# EAGLE design driver_board (EAGLE 7.5.0)

## Sheet 1 of 2
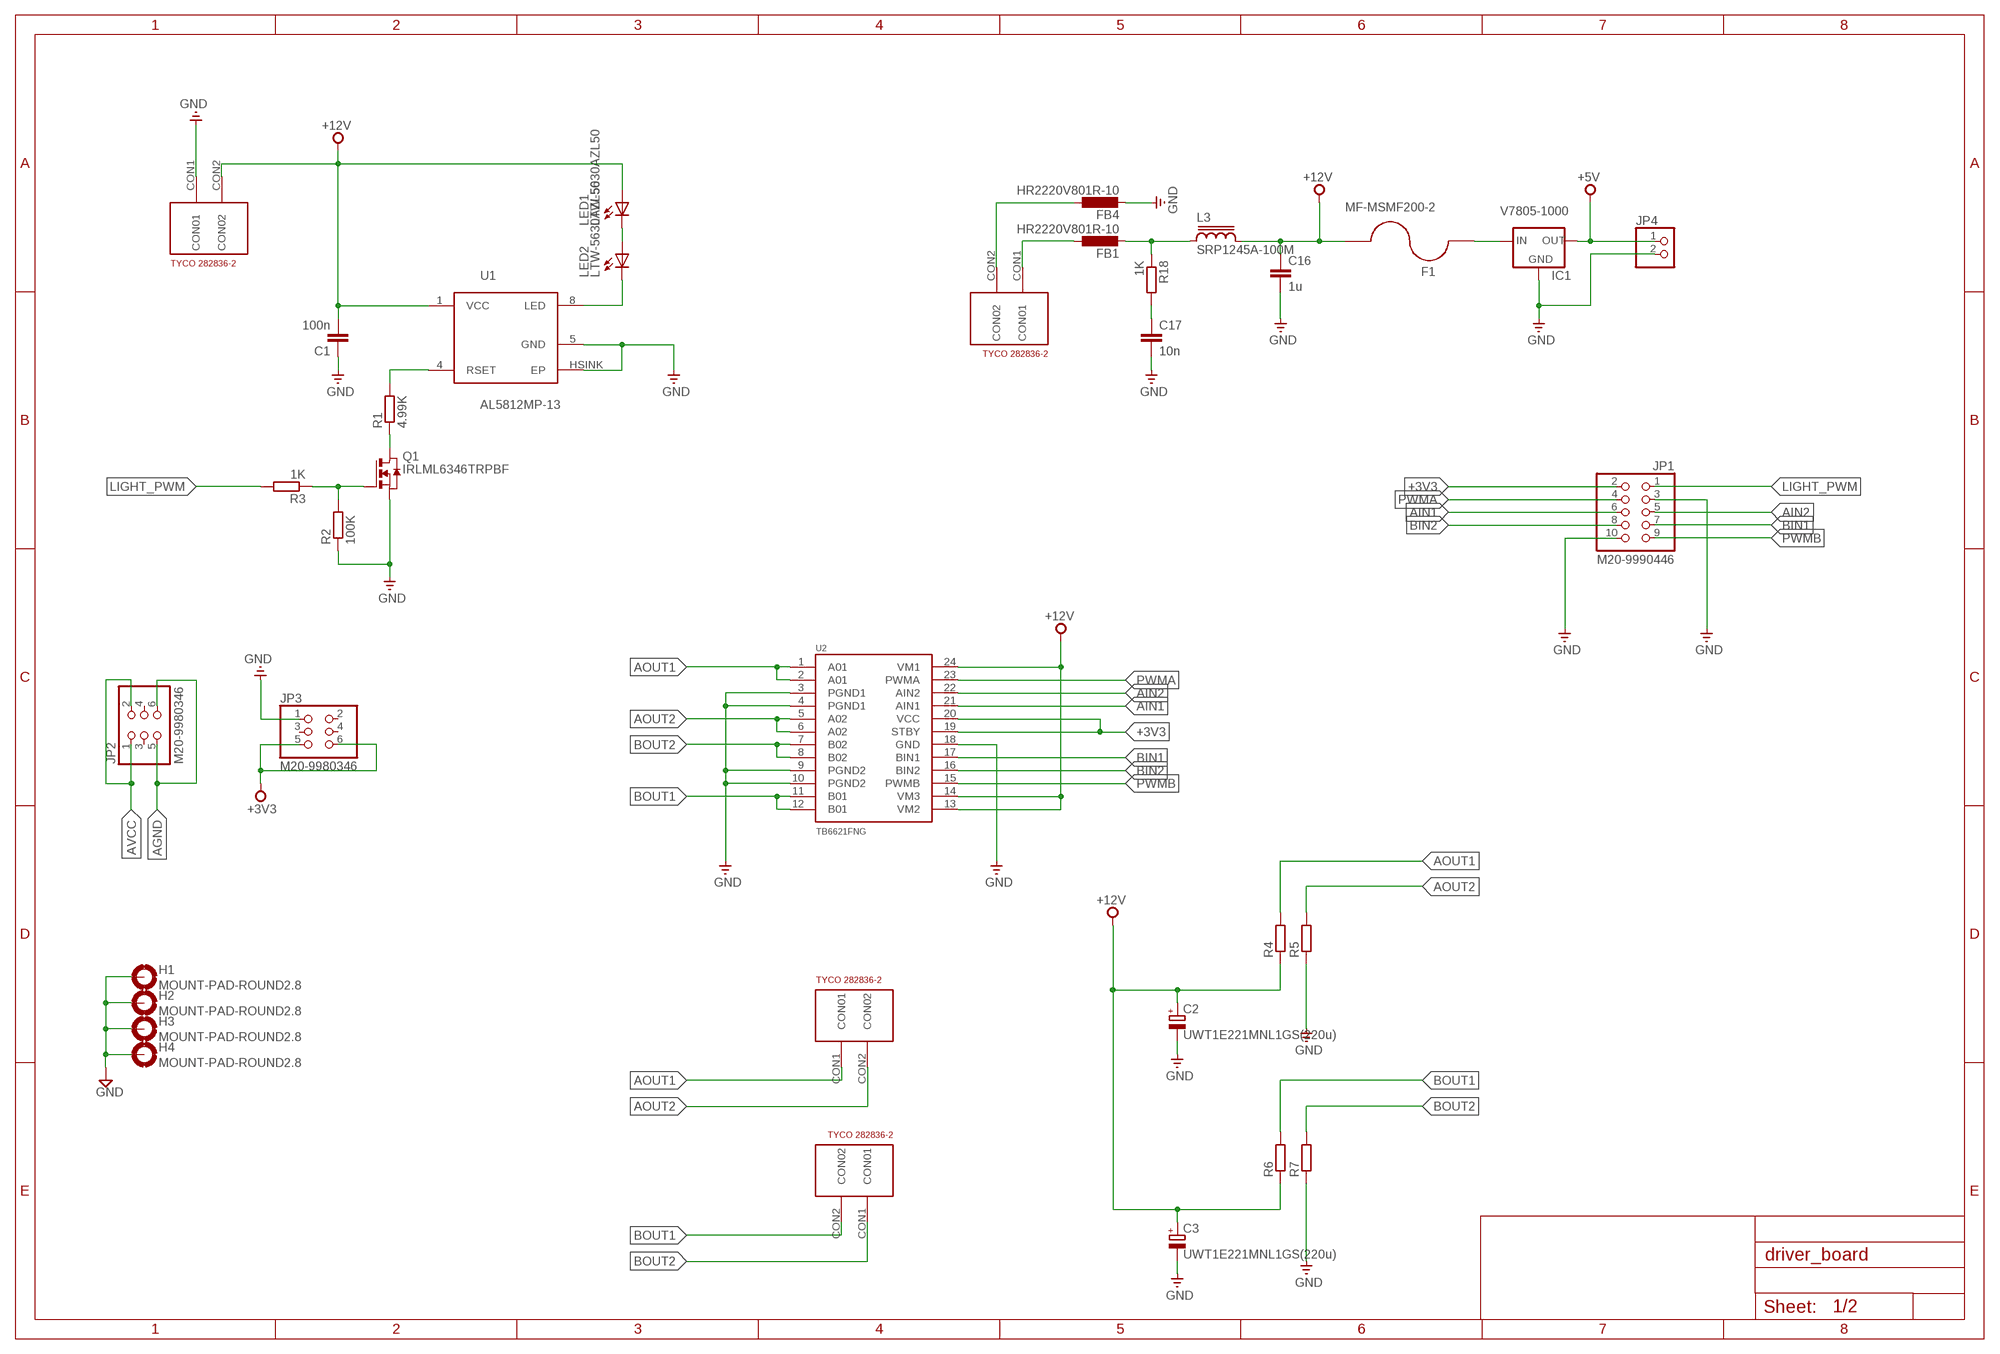
[diagram p0: schematic, sheet 1]

### Parts
C1  100n  C-EUC0402  [C0402]
C2  UWT1E221MNL1GS(220u)  CPOL-EU153CLV-0810  [153CLV-0810]
C3  UWT1E221MNL1GS(220u)  CPOL-EU153CLV-0810  [153CLV-0810]
C16  1u  C-EUC0402  [C0402]
C17  10n  C-EUC0402  [C0402]
F1  MF-MSMF200-2  MF-MSMF075/24  [1812]
FB1  HR2220V801R-10  L-EUL5650M  [L5650M]
FB4  HR2220V801R-10  L-EUL5650M  [L5650M]
H1  MOUNT-PAD-ROUND2.8  [2,8-PAD]
H2  MOUNT-PAD-ROUND2.8  [2,8-PAD]
H3  MOUNT-PAD-ROUND2.8  [2,8-PAD]
H4  MOUNT-PAD-ROUND2.8  [2,8-PAD]
IC1  V7805-1000  VR_1OUTXX  [DIP_3PIN]
JP1  M20-9990446  PINHD-2X5  [2X05]
JP2  M20-9980346  PINHD-2X3SMT  [2X03_SMT]
JP3  M20-9980346  PINHD-2X3SMT  [2X03_SMT]
JP4  PINHD-1X2  [1X02]
L3  SRP1245A-100M  SRP1250A  [SRP1250A]
LED1  LTW-5630AZL50  LTW-5630AZL  [LITEON-5630]
LED2  LTW-5630AZL50  LTW-5630AZL  [LITEON-5630]
Q1  IRLML6346TRPBF  NMOS-FETSOT23  [SOT23]
R1  4.99K  R-EU_R0402  [R0402]
R2  100K  R-EU_R0402  [R0402]
R3  1K  R-EU_R0402  [R0402]
R4  R-EU_R0805  [R0805]
R5  R-EU_R0805  [R0805]
R6  R-EU_R0805  [R0805]
R7  R-EU_R0805  [R0805]
R18  1K  R-EU_R0402  [R0402]
U1  AL5812MP-13  [MSOP-8EP]
U2  TB6621FNG  [SSOP24]
U$2  282836-2  [282836-2]
U$4  282836-2  [282836-2]
U$7  282836-2  [282836-2]
U$8  282836-2  [282836-2]

### Nets
+3V3: JP1.2 JP3.5 JP3.6 U2.19(STBY) U2.20(VCC)
+5V [VCC]: IC1.OUT JP4.1
+12V [VCC]: C1.2 C2.+ C3.+ C16.1 F1.1 L3.2 LED1.A1(A) LED1.A2(A) LED1.A3(A) R4.1 R6.1 U1.1(VCC) U2.13(VM2) U2.14(VM3) U2.24(VM1) U$4.CON2(CON02)
AGND [GND]: FB4.1 JP2.5 JP2.6 U$2.CON2(CON02)
AIN1: JP1.6 U2.21(AIN1)
AIN2: JP1.5 U2.22(AIN2)
AOUT1: R4.2 U2.1(A01) U2.2(A01) U$8.CON1(CON01)
AOUT2: R5.2 U2.5(A02) U2.6(A02) U$8.CON2(CON02)
AVCC: FB1.1 JP2.1 JP2.2 U$2.CON1(CON01)
BIN1: JP1.7 U2.17(BIN1)
BIN2: JP1.8 U2.16(BIN2)
BOUT1: R6.2 U2.11(B01) U2.12(B01) U$7.CON2(CON02)
BOUT2: R7.2 U2.7(B02) U2.8(B02) U$7.CON1(CON01)
GND [GND]: C1.1 C2.- C3.- C16.2 C17.2 FB4.2 H1.B2,8(MOUNT) H2.B2,8(MOUNT) H3.B2,8(MOUNT) H4.B2,8(MOUNT) IC1.GND JP1.3 JP1.10 JP3.1 JP4.2 Q1.2(S) R2.1 R5.1 R7.1 U1.5(GND) U1.HSINK(EP) U2.3(PGND1) U2.4(PGND1) U2.9(PGND2) U2.10(PGND2) U2.18(GND) U$4.CON1(CON01)
LIGHT_PWM: JP1.1 R3.2
N$1: LED1.C1(C) LED1.C2(C) LED2.A1(A) LED2.A2(A) LED2.A3(A)
N$3 [VCC]: FB1.2 L3.1 R18.1
N$5: R1.2 U1.4(RSET)
N$6: Q1.3(D) R1.1
N$7: Q1.1(G) R2.2 R3.1
N$9: LED2.C1(C) LED2.C2(C) U1.8(LED)
N$38: C17.1 R18.2
N$39: F1.2 IC1.IN
PWMA: JP1.4 U2.23(PWMA)
PWMB: JP1.9 U2.15(PWMB)
Unconnected: JP2.3 JP2.4 JP3.2 JP3.3 JP3.4

### Notes on the sheet
- Hole

## Sheet 2 of 2
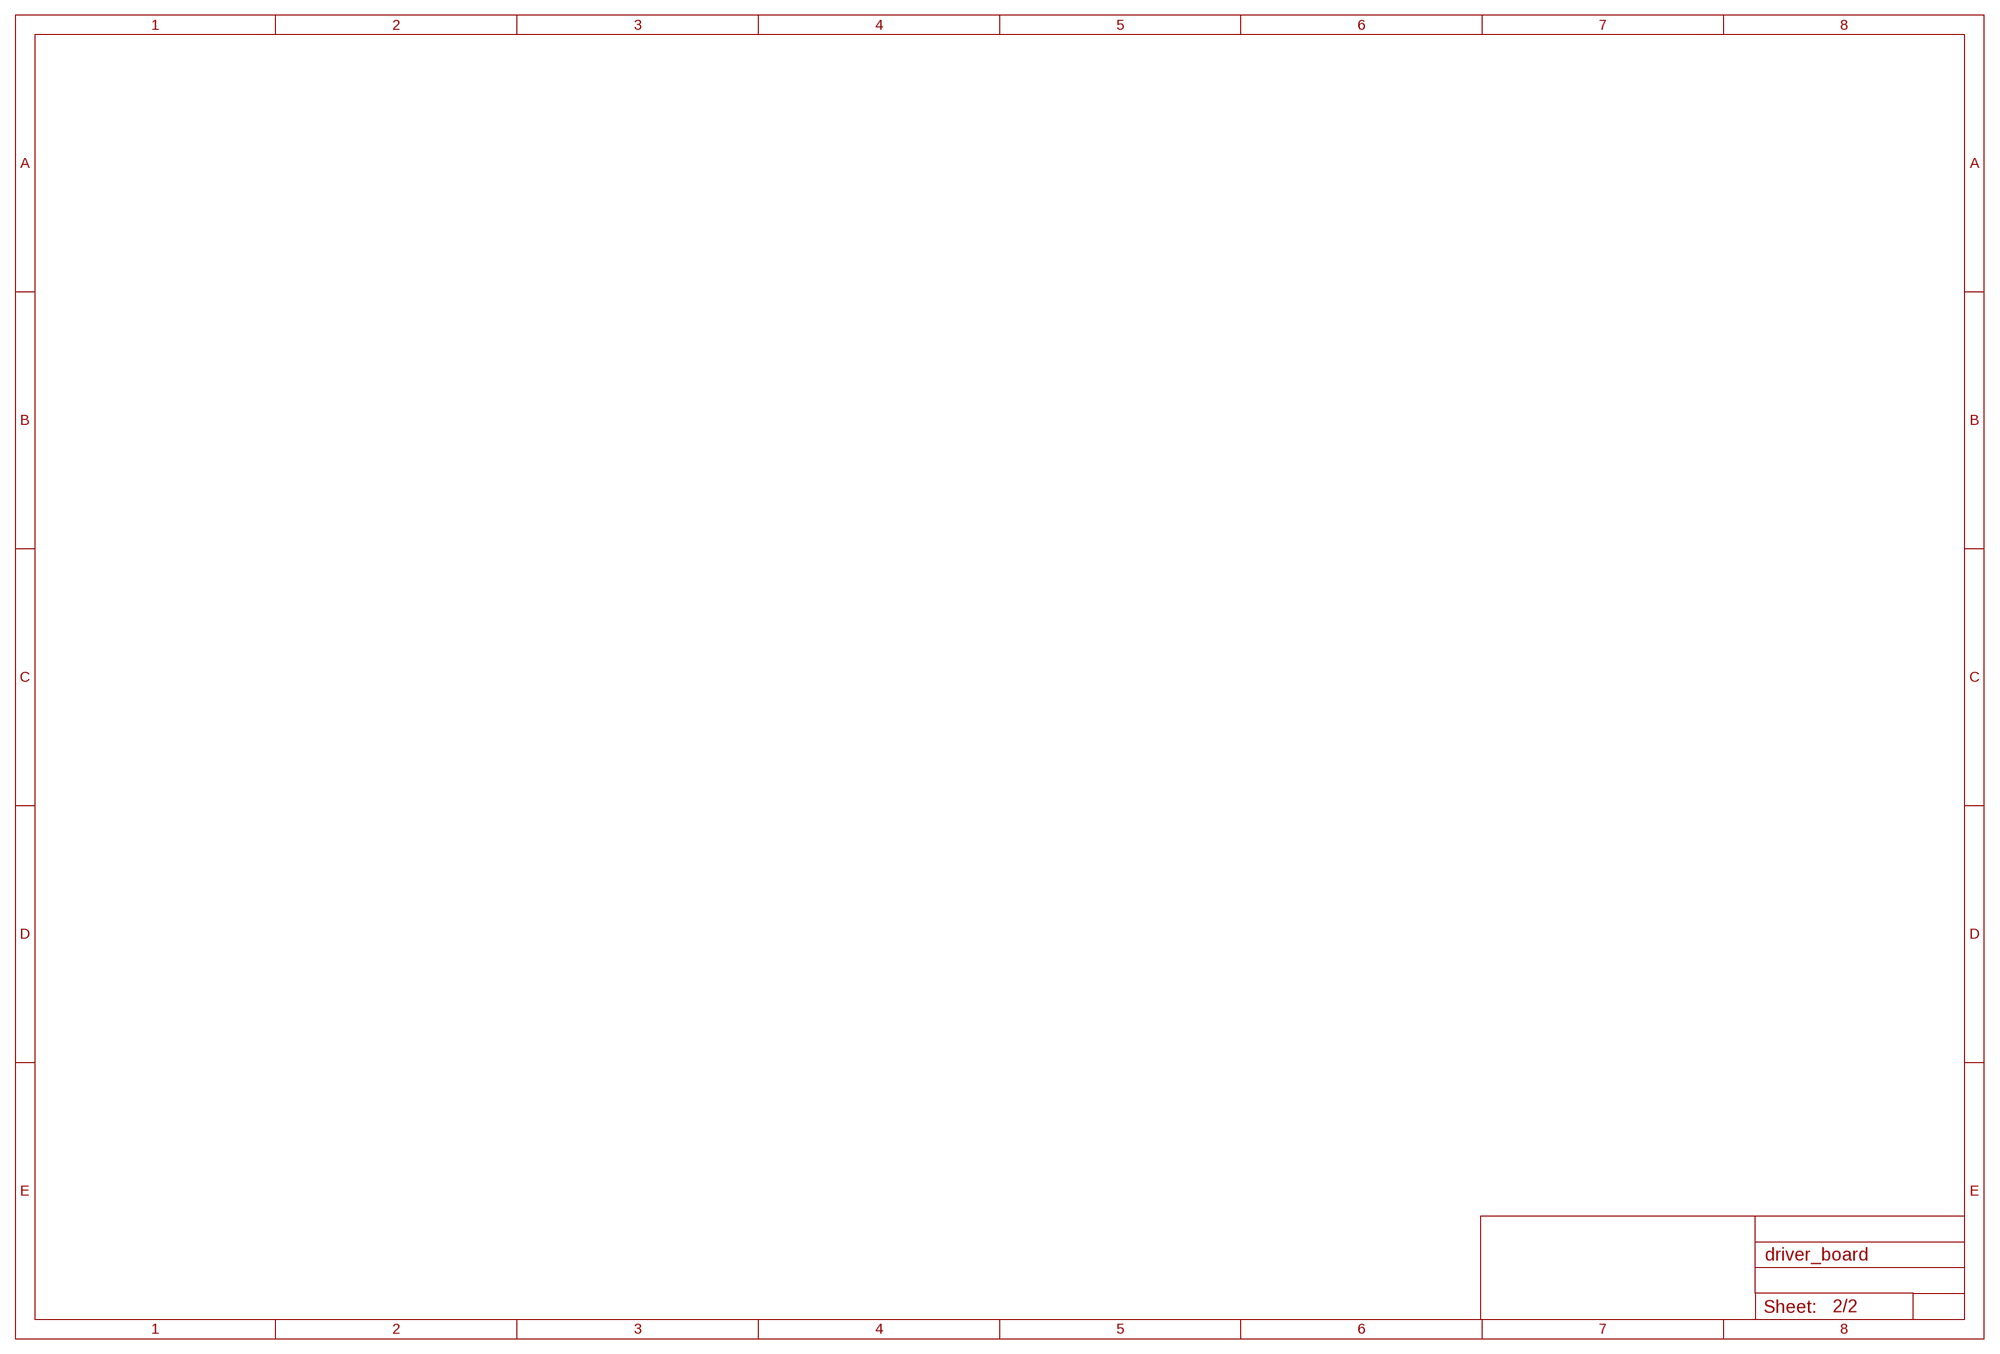
[diagram p1: schematic, sheet 2]

## Library data of the parts
C1 C16 C17 = resistor:C-EU: CAPACITOR, European symbol
C2 C3 = resistor:CPOL-EU: POLARIZED CAPACITOR, European symbol
F1 = openblw:MF-MSMF*?: PTC Resettable Fuse Documentation Datasheet <http://www.bourns.com/data/global/pdfs/mfmsmf.pdf> Features Compliant with AEC-Q200 Rev-C- Stress Test Qualification for Passive Components in Automotive Applications 100% electrically compatible with all previous generations of 1812 SMT devices Compatible with Pb and Pb-free solder reflow profiles RoHS compliant* and halogen free** Surface mount packaging for automated assembly Standard 4532 mm (1812 mils) footprint Patents pending; CATEGORY: Circuit Protection; CURRENT-MAX: 40A; CURRENT-TRIP: 1.5A; DESCRIPTION: PTC RESETTABLE .75A 24V 1812; DOCUMENTATION_LINK: <a href="http://www.bourns.com/data/global/pdfs/mfmsmf.pdf">Datasheet</a>; DOCUMENTATION_URL: http://www.bourns.com/data/global/pdfs/mfmsmf.pdf; FAMILY: PTC Resettable Fuses; MANUFACTURER: Bourns Inc.; PACKAGE: 1812 (4532 Metric), Concave; PART_NUMBER: MF-MSMF075/24-2; R_MINMAX: 0.11 ~ 0.450 Ohm; SERIES: MF-MSMF; SUPPLIER_ITEM_LINK: <a href="http://www.digikey.com/product-detail/en/MF-MSMF075%2F24-2/MF-MSMF075%2F24-2CT-ND/662844">Details</a>; SUPPLIER_ITEM_NUMBER: MF-MSMF075/24-2CT-ND; SUPPLIER_ITEM_URL: http://www.digikey.com/product-detail/en/MF-MSMF075%2F24-2/MF-MSMF075%2F24-2CT-ND/662844; SUPPLIER_LINK: <a href="http://www.digikey.com">Home Page</a>; SUPPLIER_NAME: Digi-Key; SUPPLIER_URL: http://www.digikey.com; TIME_TO_TRIP: 0.2s; VOLTAGE-MAX: 24V
FB1 FB4 = resistor:L-EU: INDUCTOR, European symbol
H1-H4 = holes:MOUNT-PAD-ROUND: MOUNTING PAD, round
IC1 = openblw:VR_1OUT: VOLTAGE REGULATOR
JP1 = pinhead:PINHD-2X5: PIN HEADER
JP2 JP3 = pinhead+:PINHD-2X3: PIN HEADER
JP4 = pinhead:PINHD-1X2: PIN HEADER
L3 = openblw:SRP1250A: POWER INDUCTOR
LED1 LED2 = openblw:LTW-5630AZL: Lite-On 5x3 mm LTW-5630AZL White LED
Q1 = openblw:NMOS-FET: Generic NMOS FET
R1-R7 R18 = resistor:R-EU_: RESISTOR, European symbol
U1 = openblw:AL5812: Diodes, Inc AL5812 LED Driver
U2 = openblw:TB6621FNG: Toshiba 1A motor driver
U$2 U$4 U$7 U$8 = openblw:282836-2: TYCO 282836-2 TERM BLOCK 2POS SIDE ENTRY 5MM EURISTYLE

## Net classes
1 GND: width 0.508 mm, drill 0.3 mm, clearance 0.2 mm to class 0, clearance 0.2 mm
5 VCC: width 0.508 mm, drill 0.3 mm, clearance 0.3 mm to class 0, clearance 0.3 mm to class 1, clearance 0.5 mm to class 2, clearance 0.5 mm to class 3, clearance 0.5 mm to class 4, clearance 0.3 mm

## Board
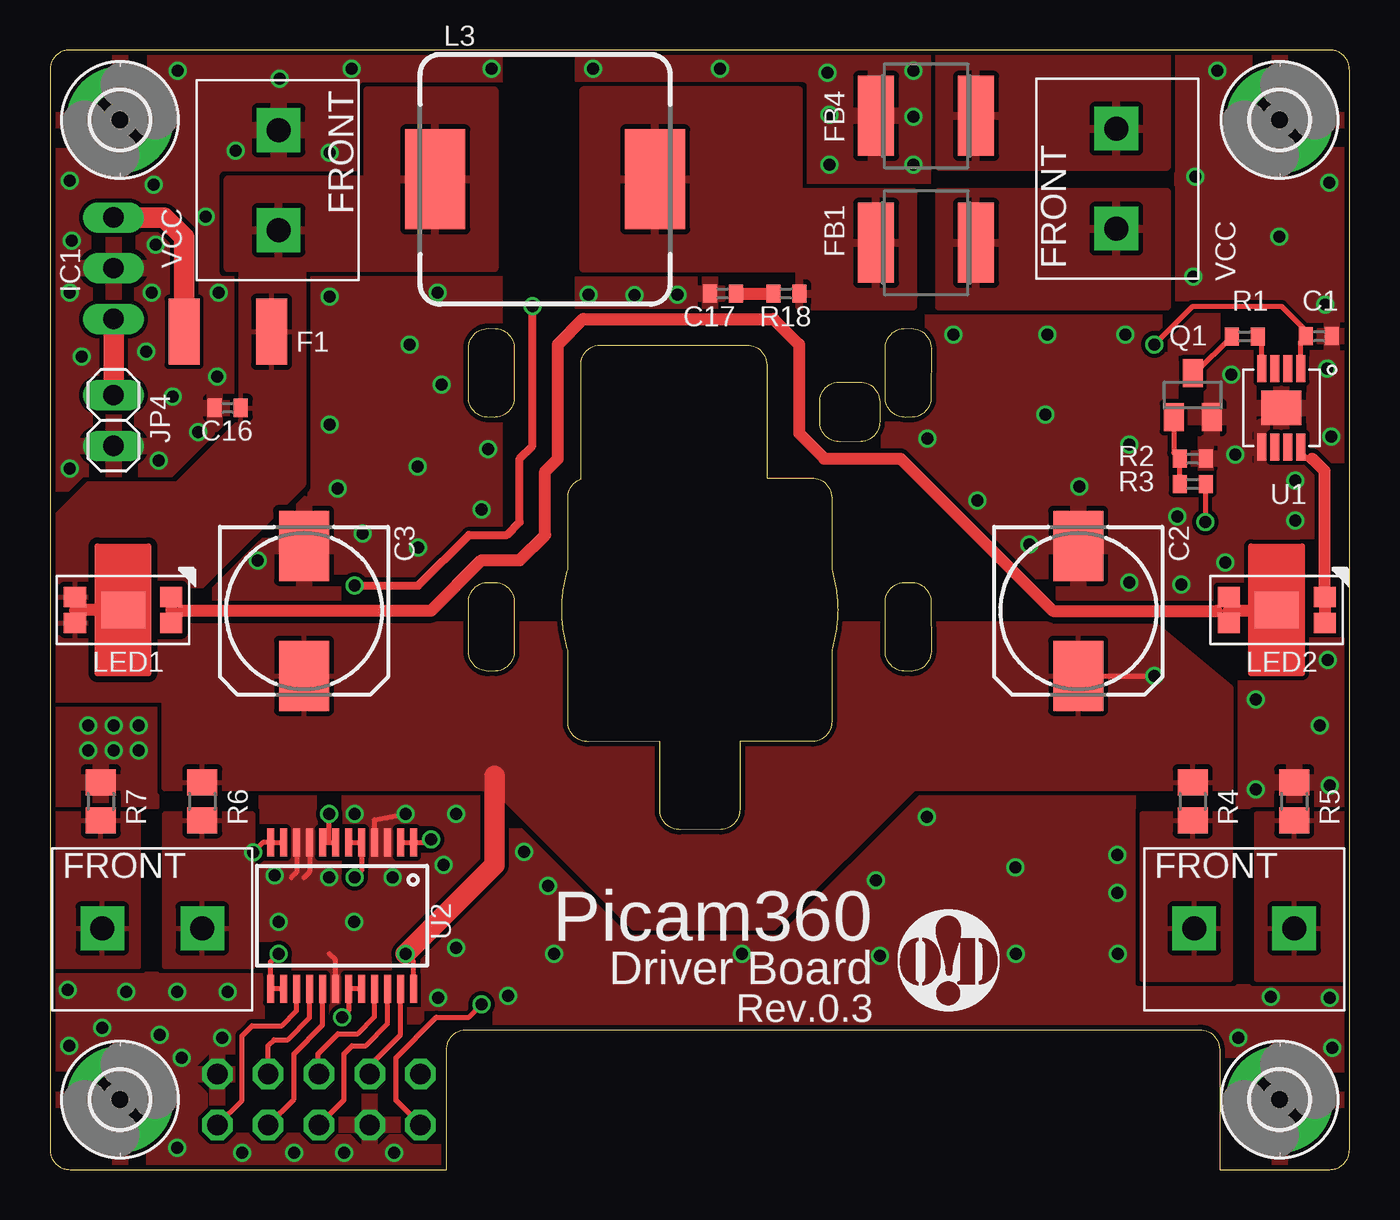
[diagram p2: board, top side]
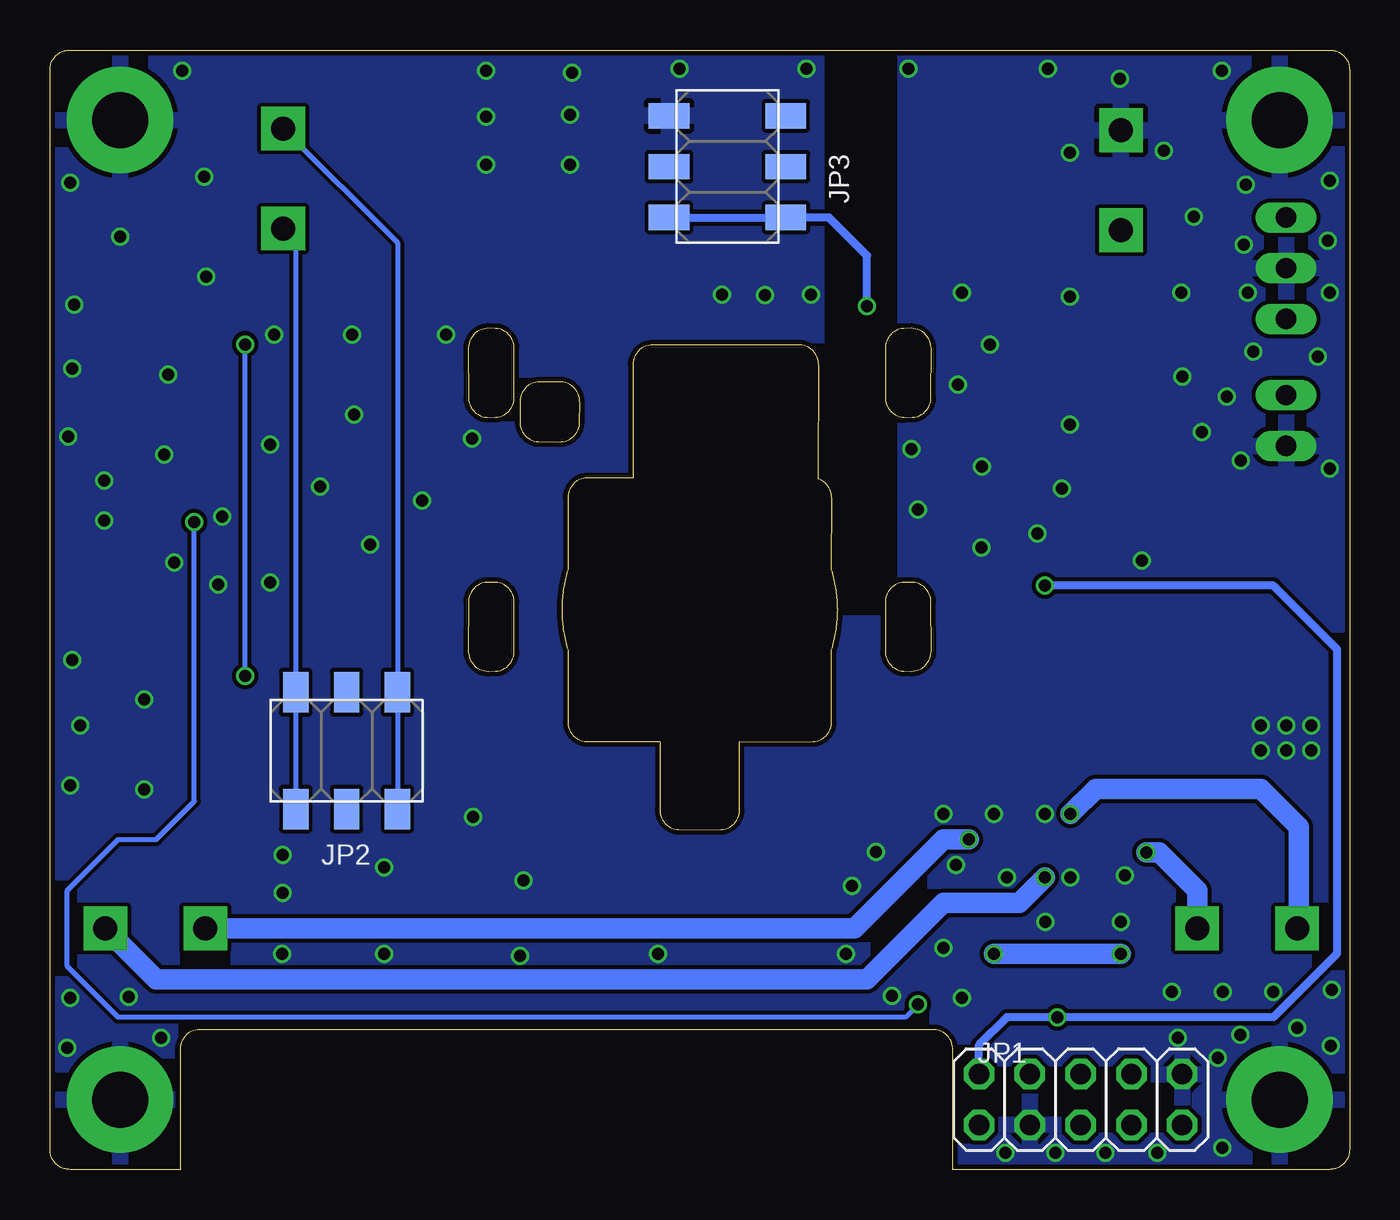
[diagram p3: board, bottom side, seen from below]

Size 65 x 56 mm. Coordinates in mm from the lower left corner, seen from the top.
Outline: 64.06,0 64.12,0.01 64.19,0.02 64.25,0.03 64.31,0.05 64.37,0.07 64.43,0.1 64.48,0.12 64.54,0.16 64.59,0.19 64.64,0.23 64.68,0.27 64.73,0.32 64.77,0.36 64.81,0.41 64.84,0.46 64.88,0.52 64.91,0.57 64.93,0.63 64.95,0.69 64.97,0.75 64.98,0.81 64.99,0.88 65,0.94 65,1 65,55 65,55.06 64.99,55.12 64.98,55.19 64.97,55.25 64.95,55.31 64.93,55.37 64.91,55.43 64.88,55.48 64.84,55.54 64.81,55.59 64.77,55.64 64.73,55.68 64.68,55.73 64.64,55.77 64.59,55.81 64.54,55.84 64.48,55.88 64.43,55.91 64.37,55.93 64.31,55.95 64.25,55.97 64.19,55.98 64.12,55.99 64.06,56 64,56 1,56 0.94,56 0.88,55.99 0.81,55.98 0.75,55.97 0.69,55.95 0.63,55.93 0.57,55.91 0.52,55.88 0.46,55.84 0.41,55.81 0.36,55.77 0.32,55.73 0.27,55.68 0.23,55.64 0.19,55.59 0.16,55.54 0.12,55.48 0.1,55.43 0.07,55.37 0.05,55.31 0.03,55.25 0.02,55.19 0.01,55.12 0,55.06 0,55 0,1 0,0.94 0.01,0.88 0.02,0.81 0.03,0.75 0.05,0.69 0.07,0.63 0.1,0.57 0.12,0.52 0.16,0.46 0.19,0.41 0.23,0.36 0.27,0.32 0.32,0.27 0.36,0.23 0.41,0.19 0.46,0.16 0.52,0.12 0.57,0.1 0.63,0.07 0.69,0.05 0.75,0.03 0.81,0.02 0.88,0.01 0.94,0 1,0 19.84,0 19.84,6 19.84,6.05 19.85,6.17 19.88,6.29 19.92,6.41 19.98,6.51 20.05,6.62 20.13,6.71 20.22,6.79 20.32,6.86 20.43,6.91 20.54,6.96 20.66,6.99 20.78,7 57.5,7 57.6,7 57.73,6.97 57.84,6.94 57.95,6.89 58.06,6.83 58.16,6.75 58.24,6.67 58.32,6.57 58.38,6.47 58.43,6.36 58.47,6.24 58.49,6.12 58.5,6 58.5,0 64,0 64.06,0
Outline: 42.72,37.63 42.6,37.64 42.48,37.67 42.37,37.71 42.26,37.77 42.16,37.84 42.07,37.92 41.99,38.01 41.92,38.11 41.86,38.22 41.82,38.33 41.79,38.45 41.78,38.57 41.78,41.11 41.79,41.23 41.81,41.35 41.85,41.47 41.91,41.58 41.98,41.68 42.06,41.77 42.15,41.85 42.24,41.92 42.35,41.98 42.47,42.03 42.58,42.06 42.7,42.07 43.08,42.08 43.18,42.07 43.3,42.05 43.42,42.02 43.53,41.97 43.63,41.9 43.73,41.83 43.82,41.74 43.89,41.65 43.96,41.54 44.01,41.43 44.05,41.32 44.07,41.2 44.08,41.08 44.07,38.59 44.06,38.47 44.04,38.35 43.99,38.23 43.94,38.12 43.87,38.02 43.79,37.93 43.7,37.85 43.6,37.78 43.5,37.72 43.38,37.67 43.27,37.64 43.15,37.63 42.77,37.62 42.72,37.63
Outline: 21.86,37.63 21.73,37.64 21.62,37.67 21.5,37.72 21.39,37.78 21.3,37.85 21.21,37.93 21.13,38.02 21.06,38.12 21,38.23 20.96,38.35 20.94,38.47 20.93,38.59 20.93,41.08 20.93,41.2 20.95,41.32 20.99,41.43 21.04,41.54 21.11,41.65 21.18,41.74 21.27,41.83 21.37,41.9 21.47,41.97 21.58,42.02 21.7,42.05 21.82,42.07 21.93,42.08 22.3,42.07 22.42,42.06 22.53,42.03 22.65,41.98 22.75,41.92 22.85,41.85 22.94,41.77 23.02,41.68 23.09,41.58 23.14,41.47 23.19,41.35 23.21,41.23 23.22,41.11 23.22,38.57 23.21,38.45 23.18,38.33 23.14,38.22 23.08,38.11 23.01,38.01 22.93,37.92 22.84,37.84 22.74,37.77 22.63,37.71 22.52,37.67 22.4,37.64 22.28,37.63 22.23,37.62 21.86,37.63
Outline: 31.45,17 31.33,17.02 31.21,17.04 31.09,17.09 30.98,17.14 30.88,17.21 30.79,17.29 30.71,17.38 30.64,17.48 30.59,17.59 30.54,17.71 30.52,17.83 30.5,17.95 30.5,21.4 30.49,21.4 26.9,21.4 26.85,21.4 26.73,21.41 26.61,21.44 26.49,21.49 26.39,21.54 26.28,21.61 26.19,21.69 26.11,21.78 26.04,21.89 25.99,21.99 25.94,22.11 25.91,22.23 25.9,22.35 25.9,25.98 25.87,26.1 25.84,26.21 25.8,26.33 25.78,26.45 25.75,26.57 25.73,26.68 25.7,26.8 25.68,26.92 25.67,27.04 25.65,27.16 25.64,27.28 25.63,27.4 25.62,27.52 25.61,27.64 25.6,27.76 25.6,27.88 25.6,28 25.6,28.12 25.6,28.24 25.61,28.36 25.62,28.48 25.63,28.6 25.64,28.72 25.65,28.84 25.67,28.96 25.68,29.08 25.7,29.2 25.73,29.32 25.75,29.43 25.78,29.55 25.8,29.67 25.84,29.79 25.87,29.9 25.9,30.01 25.9,33.6 25.9,33.65 25.91,33.77 25.94,33.89 25.99,34.01 26.04,34.12 26.11,34.22 26.19,34.31 26.28,34.39 26.39,34.46 26.49,34.51 26.55,34.53 26.55,40.25 26.55,40.3 26.57,40.42 26.59,40.54 26.64,40.66 26.69,40.77 26.76,40.87 26.84,40.96 26.93,41.04 27.04,41.11 27.14,41.16 27.26,41.21 27.38,41.23 27.5,41.25 34.85,41.25 34.95,41.24 35.08,41.22 35.19,41.19 35.3,41.14 35.41,41.08 35.51,41.01 35.59,40.92 35.67,40.82 35.73,40.72 35.78,40.61 35.82,40.49 35.84,40.37 35.85,40.25 35.85,34.6 38.1,34.6 38.2,34.59 38.33,34.57 38.44,34.54 38.55,34.49 38.66,34.43 38.76,34.35 38.84,34.27 38.92,34.17 38.98,34.07 39.03,33.96 39.07,33.84 39.09,33.72 39.1,33.6 39.1,30.01 39.13,29.9 39.16,29.79 39.2,29.67 39.22,29.55 39.25,29.43 39.27,29.32 39.3,29.2 39.31,29.08 39.33,28.96 39.35,28.84 39.36,28.72 39.37,28.6 39.38,28.48 39.39,28.36 39.4,28.24 39.4,28.12 39.4,28 39.4,27.88 39.4,27.76 39.39,27.64 39.38,27.52 39.37,27.4 39.36,27.28 39.35,27.16 39.33,27.04 39.31,26.92 39.3,26.8 39.27,26.68 39.25,26.57 39.22,26.45 39.2,26.33 39.16,26.21 39.13,26.1 39.1,25.99 39.1,22.4 39.1,22.35 39.09,22.23 39.06,22.11 39.01,21.99 38.96,21.89 38.89,21.78 38.81,21.69 38.72,21.61 38.62,21.54 38.51,21.49 38.39,21.44 38.27,21.41 38.15,21.4 34.52,21.4 34.5,21.4 34.5,18 34.5,17.95 34.48,17.83 34.46,17.71 34.41,17.59 34.36,17.48 34.29,17.38 34.21,17.29 34.12,17.21 34.02,17.14 33.91,17.09 33.79,17.04 33.67,17.02 33.55,17 31.5,17 31.45,17
Outline: 39.45,36.4 39.33,36.41 39.21,36.44 39.09,36.49 38.98,36.54 38.88,36.61 38.79,36.69 38.71,36.78 38.64,36.88 38.59,36.99 38.54,37.11 38.52,37.23 38.5,37.35 38.5,38.4 38.5,38.45 38.52,38.57 38.54,38.69 38.59,38.81 38.64,38.91 38.71,39.02 38.79,39.11 38.88,39.19 38.98,39.26 39.09,39.31 39.21,39.36 39.33,39.38 39.45,39.4 40.5,39.4 40.6,39.4 40.73,39.37 40.84,39.34 40.95,39.29 41.06,39.23 41.16,39.16 41.24,39.07 41.32,38.97 41.38,38.87 41.43,38.76 41.47,38.64 41.49,38.52 41.5,38.4 41.5,37.4 41.5,37.35 41.48,37.23 41.46,37.11 41.41,36.99 41.36,36.88 41.29,36.78 41.21,36.69 41.12,36.61 41.02,36.54 40.91,36.49 40.79,36.44 40.67,36.41 40.55,36.4 39.5,36.4 39.45,36.4
Outline: 42.7,24.93 42.58,24.94 42.47,24.97 42.35,25.02 42.24,25.08 42.15,25.15 42.06,25.23 41.98,25.32 41.91,25.43 41.85,25.53 41.81,25.65 41.79,25.77 41.78,25.89 41.78,28.43 41.79,28.55 41.82,28.67 41.86,28.78 41.92,28.89 41.99,28.99 42.07,29.08 42.16,29.16 42.26,29.23 42.37,29.29 42.48,29.33 42.6,29.36 42.72,29.37 42.77,29.38 43.15,29.37 43.27,29.36 43.38,29.33 43.5,29.28 43.6,29.22 43.7,29.15 43.79,29.07 43.87,28.98 43.94,28.88 43.99,28.77 44.04,28.65 44.06,28.53 44.07,28.41 44.08,25.93 44.07,25.8 44.05,25.68 44.01,25.57 43.96,25.46 43.89,25.35 43.82,25.26 43.73,25.17 43.63,25.1 43.53,25.03 43.42,24.98 43.3,24.95 43.18,24.93 43.08,24.93 42.7,24.93
Outline: 21.82,24.93 21.7,24.95 21.58,24.98 21.47,25.03 21.37,25.1 21.27,25.17 21.18,25.26 21.11,25.35 21.04,25.46 20.99,25.57 20.95,25.68 20.93,25.8 20.93,25.93 20.93,28.41 20.94,28.53 20.96,28.65 21,28.77 21.06,28.88 21.13,28.98 21.21,29.07 21.3,29.15 21.39,29.22 21.5,29.28 21.62,29.33 21.73,29.36 21.86,29.37 22.23,29.38 22.28,29.37 22.4,29.36 22.52,29.33 22.63,29.29 22.74,29.23 22.84,29.16 22.93,29.08 23.01,28.99 23.08,28.89 23.14,28.78 23.18,28.67 23.21,28.55 23.22,28.43 23.22,25.89 23.21,25.77 23.19,25.65 23.14,25.53 23.09,25.43 23.02,25.32 22.94,25.23 22.85,25.15 22.75,25.08 22.65,25.02 22.53,24.97 22.42,24.94 22.3,24.93 21.93,24.93 21.82,24.93
Copper layers (1*2*15*16): Top 0.035mm / dielectric 0.2mm / Route2 0.0175mm / dielectric 0.3mm / Route15 0.0175mm / dielectric 0.2mm / Bottom 0.035mm
Design rules "SeeedStudio_4layer_DRU_no_angle_20140221": minimum track width 8mil, minimum drill 12mil, track to track 8mil, track to pad 8mil, pad to pad 8mil, via to via 8mil, smd to smd 0mil, copper to edge 10mil, drill to drill 8mil, minimum pad ring 6mil, minimum via ring 4mil, stop-mask expansion 4mil, vias tented up to drill 25mil, thermal gap 10mil

### Footprints (pad centres in the part's own frame; a part is rotated, then mirrored left to right if it is on the bottom)
C0402 = smd 0.7 x 0.9: 1 -0.65,0; 2 0.65,0
153CLV-0810 = smd 3.5 x 2.5: + 3.25,0; - -3.25,0
1812 = smd 1.55 x 3.3: 1 -2.185,0; 2 2.185,0
L5650M = smd 1.8 x 4: 1 -2.5,0; 2 2.5,0
2,8-PAD = drill 2.8 pad 5.334: B2,8 0,0
DIP_3PIN = drill 1.016 long: GND 0,-2.54; IN -2.54,-2.54; OUT 2.54,-2.54
2X05 = drill 1.016 octagon: 1 -5.08,-1.27; 2 -5.08,1.27; 3 -2.54,-1.27; 4 -2.54,1.27; 5 0,-1.27; 6 0,1.27; 7 2.54,-1.27; 8 2.54,1.27; 9 5.08,-1.27; 10 5.08,1.27
2X03_SMT = smd 1.27 x 2.032: 1 -2.54,-2.921; 2 -2.54,2.921; 3 0,-2.921; 4 0,2.921; 5 2.54,-2.921; 6 2.54,2.921
1X02 = drill 1.016 long: 1 -1.27,0; 2 1.27,0
SRP1250A = smd 5 x 3: 1 0,5.5; 2 0,-5.5
LITEON-5630 = smd 1.1 x 1: A1 2.4,-0.65; A2 2.4,0.65; C1 -2.4,-0.65; C2 -2.4,0.65 | smd 2.2 x 1.8: A3 0,0
SOT23 = smd 1 x 1.4: 1 -0.95,-1.1; 2 0.95,-1.1; 3 0,1.1
R0402 = smd 0.7 x 0.9: 1 -0.65,0; 2 0.65,0
R0805 = smd 1.3 x 1.5: 1 -0.95,0; 2 0.95,0
MSOP-8EP = smd 0.45 x 1.35: 1 -0.975,-1.975; 2 -0.325,-1.975; 3 0.325,-1.975; 4 0.975,-1.975; 5 0.975,1.975; 6 0.325,1.975; 7 -0.325,1.975; 8 -0.975,1.975 | smd 2 x 1.7: HSINK 0,0
SSOP24 = smd 0.348 x 1.397: 1 -3.575,-3.656; 2 -2.925,-3.656; 3 -2.275,-3.656; 4 -1.625,-3.656; 5 -0.975,-3.656; 6 -0.325,-3.656; 7 0.325,-3.656; 8 0.975,-3.656; 9 1.625,-3.656; 10 2.275,-3.656; 11 2.925,-3.656; 12 3.575,-3.656; 13 3.575,3.656; 14 2.925,3.656; 15 2.275,3.656; 16 1.625,3.656; 17 0.975,3.656; 18 0.325,3.656; 19 -0.325,3.656; 20 -0.975,3.656; 21 -1.625,3.656; 22 -2.275,3.656; 23 -2.925,3.656; 24 -3.575,3.656
282836-2 = drill 1.2 pad 2.184 square: CON1 -2.46,0; CON2 2.54,0

### Placement (x,y rotation side)
C1  63.47,41.69 180 top
C2  51.44,27.94 270 top
C3  12.7,27.94 270 top
C16  8.89,38.1 180 top
C17  33.66,43.81 180 top
F1  8.89,41.91 180 top
FB1  43.81,46.35 180 top
FB4  43.81,52.7 180 top
H1  3.5,3.5 0 top
H2  61.5,3.5 0 top
H3  3.5,52.5 0 top
H4  61.5,52.5 0 top
IC1  5.71,45.09 270 top
JP1  13.45,3.5 0 bottom
JP2  50.16,20.95 0 bottom
JP3  31.11,50.16 270 bottom
JP4  3.17,37.47 270 top
L3  24.77,49.53 270 top
LED1  3.65,28 180 top
LED2  61.35,28 180 top
LOGO1  [OHMYDIGIFAB_LOGO]  44.96,10.41 0 top
Q1  57.15,38.73 0 top
R1  59.76,41.67 0 top
R2  57.15,35.56 180 top
R3  57.15,34.29 0 top
R4  57.15,18.41 270 top
R5  62.23,18.41 270 top
R6  7.62,18.41 270 top
R7  2.54,18.41 270 top
R18  36.83,43.81 180 top
U1  61.59,38.1 180 top
U2  14.61,12.7 180 top
U$2  53.34,49.53 90 top
U$3  [TENDA_P200]  53.98,18.41 0 bottom
U$4  11.43,49.53 270 top
U$7  5.08,12.06 0 top
U$8  59.69,12.06 0 top

### Tracks (layer width: path | path; a pad name or v marks a point on that pad's centre or on a via)
+3V3  (via drill 0.6)
  Top 0.254: v14.61,7.62 14.93,7.95 U2.19 U2.20
  Top 0.406: v15.24,29.21 18.41,29.21 20.95,31.75 22.86,31.75 23.5,32.38 23.5,35.56 24.13,36.2 v24.13,43.18
  Bottom 0.406: JP3.5 JP3.6 26.04,47.62 24.13,45.72 v24.13,43.18 | JP1.2 18.53,6.24 17.14,7.62 v14.61,7.62 3.81,7.62 0.64,10.79 0.64,26.04 3.81,29.21 v15.24,29.21
+5V
  Top 1.016: IC1.OUT JP4.1
+12V  (via drill 0.6)
  Top 0.254: U1.1 62.57,41.44 C1.2 62.82,41.95 61.59,43.18 57.15,43.18 v55.24,41.27 | 2.54,26.89 LED1.A3 | 1.31,28 1.25,27.94 | U2.14 U2.13 11.03,10.39 v11.43,10.79 | C2.+ v55.24,24.69 | U2.24 18.18,10.39 v17.78,10.79
  Top 0.61: LED1.A1 1.25,27.94 LED1.A2 | LED1.A3 1.31,28
  Top 1.016: v17.78,10.79 22.23,15.24 22.23,19.68
  Bottom 0.254: v55.24,24.69 v55.24,41.27
  Bottom 1.016: v11.43,10.79 v17.78,10.79
  pour Top: 8.89,49.53 15.88,49.53 15.88,53.98 22.23,53.98 22.23,45.09 8.89,45.09
  pour Top: 0,23.5 5.71,23.5 5.71,29.21 7.62,29.21 12.7,34.29 12.7,45.09 9.53,45.09 9.53,37.47 6.35,34.29 1.91,34.29 0,32.38
  pour Top: 5.71,27.3 55.24,27.3 59.05,24.13 59.05,19.05 43.18,19.05 36.2,12.06 29.21,12.06 22.23,19.05 5.71,19.05
AGND
  Bottom 0.254: U$2.CON2 47.62,46.35 JP2.6 JP2.5
  pour Top: 44.45,55.88 44.45,50.16 55.88,50.16 55.88,55.88
AIN1
  Top 0.254: JP1.6 13.4,4.82 13.4,5.8 14.4,6.8 15.4,6.8 16.23,7.63 U2.21
AIN2
  Top 0.254: JP1.5 14.7,3.48 14.7,5.8 15.1,6.2 15.8,6.2 16.88,7.28 U2.22
AOUT1  (via drill 0.6)
  Top 0.254: U2.2 U2.1 18.9,16.36 v19.05,16.51
  Bottom 1.016: v19.05,16.51 20.32,16.51 24.77,12.06 U$8.CON1
  pour Top: 59.05,17.78 54.61,17.78 54.61,9.53 59.05,9.53
AOUT2  (via drill 0.6)
  Top 0.254: U2.6 U2.5 15.58,14.95 v15.24,14.61
  Bottom 1.016: v15.24,14.61 16.51,13.34 20.32,13.34 24.13,9.53 59.69,9.53 U$8.CON2
  pour Top: 64.77,17.78 60.33,17.78 60.33,9.53 64.77,9.53
AVCC
  Bottom 0.254: U$2.CON1 52.7,46.44 JP2.2 JP2.1
  pour Top: 44.45,48.9 44.45,43.18 55.88,43.18 55.88,48.9
BIN1
  Top 0.254: JP1.7 12.2,3.52 12.2,5.8 13.63,7.23 U2.17
BIN2
  Top 0.254: JP1.8 10.91,6.21 11.2,6.5 11.9,6.5 12.98,7.58 U2.16
BOUT1  (via drill 0.6)
  Top 0.254: U2.11 U2.12 10.64,16.36 v10.16,15.88
  Bottom 1.016: v10.16,15.88 9.53,15.88 7.62,13.97 U$7.CON2
  pour Top: 10.16,17.78 5.71,17.78 5.71,10.16 10.16,10.16
BOUT2  (via drill 0.6)
  Top 0.254: U2.7 U2.8 13.97,16.36 v13.97,17.78
  Bottom 1.016: v13.97,17.78 12.7,19.05 4.45,19.05 2.54,17.14 2.54,12.14 U$7.CON1
  pour Top: 4.45,17.78 0,17.78 0,10.16 4.45,10.16
GND  (via drill 0.6)
  Top 0.254: U2.18 14.28,10.48 13.97,10.79 | U2.9 12.98,14.88 12.7,14.61 | U2.10 12.33,14.87 12.06,14.61 | U2.4 16.23,17.5 v17.78,17.78
  other vias: 21.59,33.02 63.5,22.23 64.14,6.08 43.85,17.64 11.23,14.71 11.43,12.4 15.21,12.4 20.32,11.1 1.91,22.23 3.17,22.23 4.45,22.23 4.45,20.95 3.17,20.95 1.91,20.95 15.24,17.78 20.32,17.78 8.89,8.89 6.35,8.89 0.95,6.19 0.88,8.99 3.81,8.89 13.97,14.61 17.14,14.61 19.68,15.24 8.6,6.6 5.47,6.75 6.36,1.1 17.21,0.83 14.71,0.83 12.21,0.83 9.61,0.83 2.62,7.09 59.44,6.58 64,8.6 53.38,15.74 41.31,14.47 53.38,13.84 48.3,15.11 5.43,35.47 4.82,40.91 6.14,38.66 0.99,35.06 1.59,40.66 0.99,43.87 5.29,46.27 5.09,43.87 1.09,46.47 0.99,49.47 7.79,47.66 5.19,49.27 6.39,54.97 9.29,50.97 13.99,50.87 11.49,54.56 15.09,55.06 13.99,43.66 19.39,43.87 17.99,41.27 13.99,37.27 14.39,34.06 19.59,39.27 15.62,31.8 10.39,30.46 21.92,36.03 18.39,35.16 31.39,43.77 38.89,54.87 38.99,50.27 58.39,54.97 57.19,44.66 63.79,43.27 63.99,49.37 57.29,49.66 61.49,46.66 53.79,41.77 45.19,41.77 43.89,36.56 49.89,41.77 48.99,31.27 46.39,33.47 51.49,34.16 49.79,37.77 53.99,29.36 53.99,36.27 59.09,39.77 64.09,36.66 63.89,40.06 59.29,35.77 62.29,34.47 62.29,32.47 58.79,30.36 56.59,29.27 56.39,32.66 60.3,23.52 60.3,19.02 64,19.23 63.9,25.5 43.19,54.97 43.19,52.66 43.19,50.27 38.99,52.77 6.59,5.6 23.7,15.9 24.9,14.2 53.4,10.8 48.3,10.8 41.5,10.7 34.6,10.8 25.2,10.8 61.06,8.64 22.9,8.7 19.4,8.6 8.43,43.85 8.36,39.67 7.4,36.9 18.41,31.11 26.95,43.77 29.24,43.75 22.07,55.06 27.16,55.06 33.51,55.06
  pour Top (rank 6): 0,55.88 0,0 19.68,0 19.68,6.99 58.42,6.99 58.42,0 65,0 65,56 26.67,55.88 26.67,27.3 22.23,27.3 22.23,55.88
  pour Bottom (rank 6): 0,55.88 0,0 19.68,0 19.68,6.99 58.42,6.99 58.42,0 65,0 65,56 26.67,55.88 26.67,27.3 22.23,27.3 22.23,55.88
LIGHT_PWM  (via drill 0.6)
  Top 0.254: v57.78,32.38 57.8,32.4 R3.2 | v21.59,8.26 20.95,7.62 19.32,7.62 17.3,5.6 17.3,3.46 JP1.1
  Bottom 0.254: v21.59,8.26 22.23,7.62 61.59,7.62 64.14,10.16 64.14,13.97 61.59,16.51 59.69,16.51 57.78,18.41 v57.78,32.38
N$1
  Top 0.254: 58.95,27.94 LED2.A1 58.88,28.57 | LED2.A3 61.53,28 61.59,27.94 | 58.36,27.94 LED2.A2 | 6.64,27.94 LED1.C2
  Top 0.61: LED1.C1 LED1.C2 | LED2.A2 58.95,27.94 61.59,27.94 | 58.36,27.94 50.16,27.94 42.55,35.56 38.73,35.56 37.47,36.83 37.47,41.27 36.2,42.55 26.67,42.55 25.4,41.27 25.4,35.56 24.77,34.92 24.77,31.75 23.5,30.48 21.59,30.48 19.05,27.94 6.64,27.94
N$3
  pour Top: 26.67,53.98 26.67,45.09 37.47,45.09 37.47,43.18 43.18,43.18 43.18,48.9 37.47,48.9 37.47,53.98
N$5
  Top 0.254: U1.4 60.62,41.45 R1.2
N$6
  Top 0.254: Q1.3 57.27,39.84 R1.1
N$7
  Top 0.254: R3.1 R2.2 56.2,35.86 Q1.1
N$9
  Top 0.254: U1.8 62.57,35.85 62.87,35.56 63.13,35.56
  Top 0.61: LED2.C2 LED2.C1 63.75,34.95 63.13,35.56
N$38
  Top 0.61: C17.1 R18.2
N$39
  Top 1.016: F1.2 6.71,46.63 5.71,47.62 IC1.IN
PWMA
  Top 0.254: JP1.4 15.99,5.2 17.53,6.74 U2.23
PWMB
  Top 0.254: JP1.9 9.6,3.46 9.6,6.7 10.1,7.2 11.6,7.2 12.33,7.93 U2.15

### Text on the board
tPlace: VCC | VCC | Picam360 | Driver Board | Rev.0.3